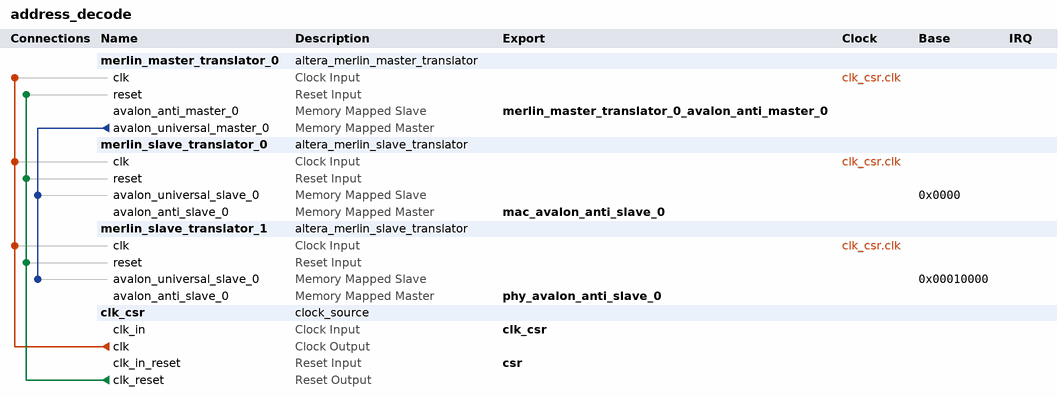
[diagram p0: system contents]
# Platform Designer (Qsys) system address_decode, Arria 10 10AX115R3F40I2SGES
# Parameters at their usual value, and those the tool derives, are not listed.
package require -exact qsys 1.0
create_system address_decode
set_project_property DEVICE_FAMILY {Arria 10}
set_project_property DEVICE 10AX115R3F40I2SGES

add_component merlin_master_translator_0 ip/address_decode/address_decode_merlin_master_translator_0.ip altera_merlin_master_translator merlin_master_translator_0 18.0

add_component merlin_slave_translator_0 ip/address_decode/address_decode_merlin_slave_translator_0.ip altera_merlin_slave_translator merlin_slave_translator_0 18.0

add_component merlin_slave_translator_1 ip/address_decode/address_decode_merlin_slave_translator_1.ip altera_merlin_slave_translator merlin_slave_translator_1 18.0

add_component clk_csr ip/address_decode/address_decode_clk_csr.ip clock_source clk_csr 

# connections
add_connection clk_csr.clk merlin_master_translator_0.clk clock
add_connection clk_csr.clk merlin_slave_translator_0.clk clock
add_connection clk_csr.clk merlin_slave_translator_1.clk clock
add_connection clk_csr.clk_reset merlin_master_translator_0.reset reset
add_connection clk_csr.clk_reset merlin_slave_translator_0.reset reset
add_connection clk_csr.clk_reset merlin_slave_translator_1.reset reset
add_connection merlin_master_translator_0.avalon_universal_master_0 merlin_slave_translator_0.avalon_universal_slave_0 avalon
set_connection_parameter_value merlin_master_translator_0.avalon_universal_master_0/merlin_slave_translator_0.avalon_universal_slave_0 baseAddress 0x0000
add_connection merlin_master_translator_0.avalon_universal_master_0 merlin_slave_translator_1.avalon_universal_slave_0 avalon
set_connection_parameter_value merlin_master_translator_0.avalon_universal_master_0/merlin_slave_translator_1.avalon_universal_slave_0 baseAddress 0x00010000

# exported interfaces
add_interface clk_csr clock sink
set_interface_property clk_csr EXPORT_OF clk_csr.clk_in
add_interface csr reset sink
set_interface_property csr EXPORT_OF clk_csr.clk_in_reset
add_interface mac_avalon_anti_slave_0 avalon master
set_interface_property mac_avalon_anti_slave_0 EXPORT_OF merlin_slave_translator_0.avalon_anti_slave_0
add_interface merlin_master_translator_0_avalon_anti_master_0 avalon slave
set_interface_property merlin_master_translator_0_avalon_anti_master_0 EXPORT_OF merlin_master_translator_0.avalon_anti_master_0
add_interface phy_avalon_anti_slave_0 avalon master
set_interface_property phy_avalon_anti_slave_0 EXPORT_OF merlin_slave_translator_1.avalon_anti_slave_0

set_interconnect_requirement {$system} qsys_mm.clockCrossingAdapter HANDSHAKE
set_interconnect_requirement {$system} qsys_mm.insertDefaultSlave FALSE
set_interconnect_requirement {$system} qsys_mm.maxAdditionalLatency 1

save_system address_decode.qsys
